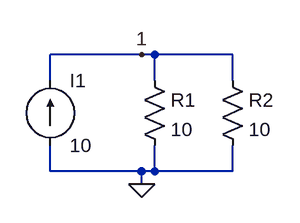
[diagram p0: schematic circuit-2.asc]
circuit-2.asc, the LTspice schematic file:
Version 4
SHEET 1 880 680
WIRE 144 112 32 112
WIRE 160 112 144 112
WIRE 256 112 160 112
WIRE 32 144 32 112
WIRE 160 144 160 112
WIRE 256 144 256 112
WIRE 32 256 32 224
WIRE 144 256 32 256
WIRE 160 256 160 224
WIRE 160 256 144 256
WIRE 256 256 256 224
WIRE 256 256 160 256
WIRE 144 272 144 256
FLAG 144 272 0
FLAG 144 112 1
SYMBOL res 144 128 R0
SYMATTR InstName R1
SYMATTR Value 10
SYMBOL res 240 128 R0
SYMATTR InstName R2
SYMATTR Value 10
SYMBOL current 32 224 M180
WINDOW 0 24 80 Left 2
WINDOW 3 24 0 Left 2
SYMATTR InstName I1
SYMATTR Value 10

The netlist it stands for:
* circuit-2.asc
R1 1 0 10
R2 1 0 10
I1 0 1 10
.backanno
.end